# EAGLE design TECDriver Low Voltage (EAGLE 9.6.2)
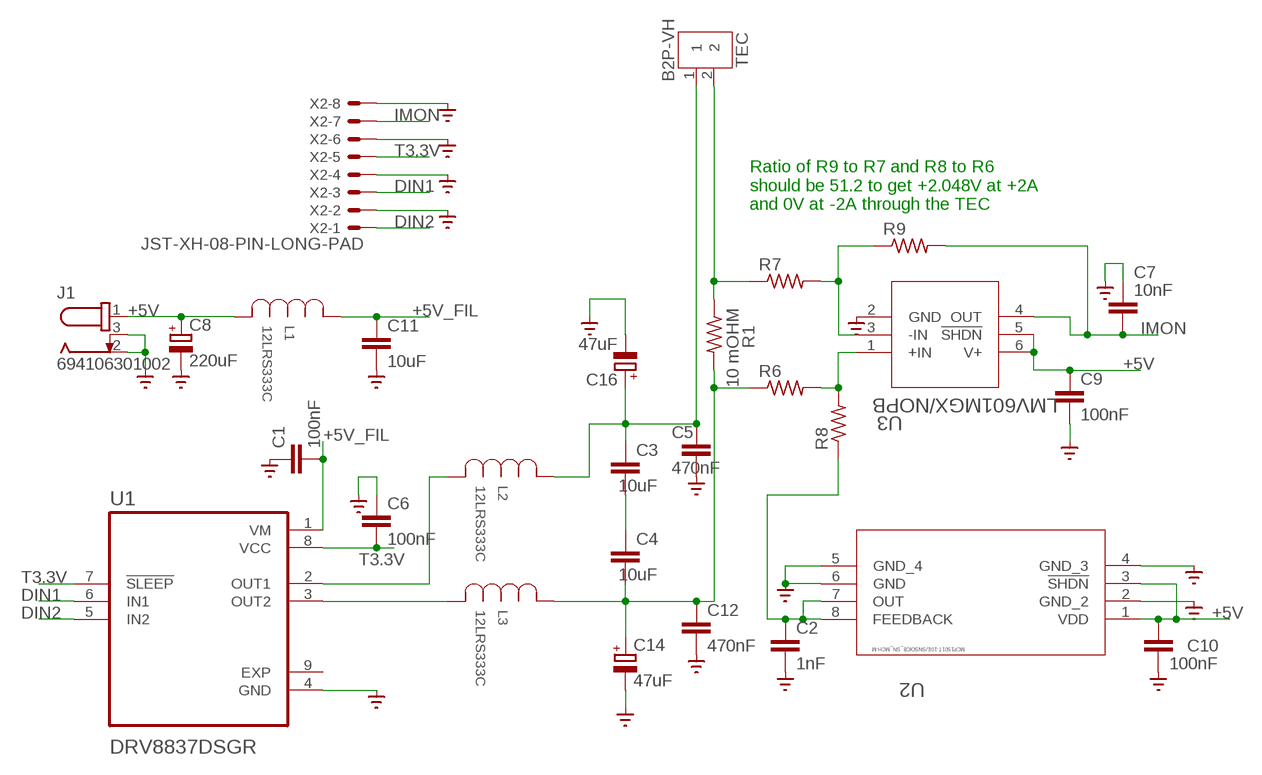
[diagram p0: schematic, sheet 1]

## Parts
C1  100nF  C-EUC0603  [C0603]
C2  1nF  C-EUC0603  [C0603]
C3  10uF  C-EUC1206  [C1206]
C4  10uF  C-EUC1206  [C1206]
C5  470nF  C-EUC1206  [C1206]
C6  100nF  C-EUC0603  [C0603]
C7  10nF  C-EUC0603  [C0603]
C8  220uF  CPOL-EUE3.5-8  [E3,5-8]
C9  100nF  C-EUC0603  [C0603]
C10  100nF  C-EUC0603  [C0603]
C11  10uF  C-EUC1206  [C1206]
C12  470nF  C-EUC1206  [C1206]
C14  47uF  CPOL-EU175TMP-0808  [175TMP-0808]
C16  47uF  CPOL-EU175TMP-0808  [175TMP-0808]
J1  694106301002  [694106301002]
L1  12LRS333C  [IND_MURATA_1200LRS_MUR]
L2  12LRS333C  [IND_MURATA_1200LRS_MUR]
L3  12LRS333C  [IND_MURATA_1200LRS_MUR]
R1  10 mOHM  R-US_R1206  [R1206]
R6  R-US_R1206  [R1206]
R7  R-US_R1206  [R1206]
R8  R-US_R1206  [R1206]
R9  R-US_R1206  [R1206]
TEC  B2P-VH  [B2P-VH_396-2N]
U1  DRV8837DSGR  [SON50P200X200X80-9N]
U2  MCP1501T-10E/SNSOIC8_SN_MCH-M  [SOIC8_SN_MCH-M]
U3  LMV601MGX/NOPB  [DCK6_TEX]
X2  JST-XH-08-PIN-LONG-PAD  [JST-XH-08-PACKAGE-LONG-PAD]

## Nets
+5V: C8.+ C9.1 C10.1 J1.1 L1.3 U2.1(VDD) U2.3(!SHDN) U3.5(!SHDN) U3.6(V+)
+5V_FIL: C1.2 C11.1 L1.1 U1.1(VM)
DIN1: U1.6(IN1) X2.3
DIN2: U1.5(IN2) X2.1
GND: C1.1 C2.2 C5.2 C6.1 C7.1 C8.- C9.2 C10.2 C11.2 C12.2 C14.- C16.- J1.2 J1.3 U1.4(GND) U2.2(GND_2) U2.4(GND_3) U2.5(GND_4) U2.6(GND) U3.2(GND) X2.2 X2.4 X2.6 X2.8 ; supply symbol labelled SUPPLY0_GND_
IMON: C7.2 R9.2 U3.4(OUT) X2.7
N$1: R6.2 R8.2 U3.1(+IN)
N$2: C2.1 R8.1 U2.7(OUT) U2.8(FEEDBACK)
N$5: L2.3 U1.2(OUT1)
N$7: L3.3 U1.3(OUT2)
N$8: R7.2 R9.1 U3.3(-IN)
N$9: C3.1 C5.1 C16.+ L2.1 TEC.1
N$10: C3.2 C4.1
N$11: C4.2 C12.1 C14.+ L3.1 R1.2 R6.1
N$14: R1.1 R7.1 TEC.2
T3.3V: C6.2 U1.7(!SLEEP) U1.8(VCC) X2.5

## Notes on the sheet
- Ratio of R9 to R7 and R8 to R6 
  should be 51.2 to get +2.048V at +2A
  and 0V at -2A through the TEC

## Power pins joined to a net without a drawn wire
EXP: U1.9(EXP)

## Library data of the parts
C1-C7 C9-C12 = rcl:C-EU: CAPACITOR, European symbol; SPICEPREFIX: C
C8 C14 C16 = rcl:CPOL-EU: POLARIZED CAPACITOR, European symbol; SPICEPREFIX: C
J1 = DC Power Jacks:694106301002: CONN PWR JACK 2.1X5.5MM SOLDER Manufacturer's datasheet <https://katalog.we-online.de/em/datasheet/6941xx301002.pdf>; CREATED_BY: PCBLayout.com; DIGIKEY_PART_NUMBER: 732-5930-ND; MANUFACTURER: Wurth Electronics Inc.; MPN: 694106301002
L1-L3 = 12LRS333C:12LRS333C: MURATA 33uH 2.1A INDUCTOR; BUILT_BY: EMA_UL_Team; MANUFACTURER_PART_NUMBER: 12LRS333C; SOURCELIBRARY: Murata_2010-01-01IND_1200LRS; VENDOR: Murata
R1 R6-R9 = rcl:R-US_: RESISTOR, American symbol; SPICEPREFIX: R
TEC = Connector:B2P-VH: VH Connector Top Entry - 2POS, 3.96MM Details see: Datasheet <http://www.jst-mfg.com/product/pdf/eng/eVH.pdf>; CATEGORY: Connector; DESCRIPTION: CONN HEADER VERT 2POS 3.96MM; MANUFACTURER: JST Sales America Inc.; MPN: B2P-VH; OPERATING_TEMPERATURE: -25°C ~ 85°C; PART_STATUS: Active; ROHS_COMPLIANCE: RoHS2 Compliant; SERIES: VH; TYPE: Top Entry
U1 = DRV8837DSGR:DRV8837DSGR: Check prices <https://pricing.snapeda.com/parts/DRV8837DSGR/Texas%20Instruments/view-part?ref=eda>; AVAILABILITY: In Stock; DESCRIPTION: 11-V, 1.8-A H-bridge motor driver 8-WSON -40 to 85; MF: Texas Instruments; MP: DRV8837DSGR; PACKAGE: WSON-8 Texas Instruments; PRICE: None; PURCHASE-URL: https://pricing.snapeda.com/search/part/DRV8837DSGR/?ref=eda
U2 = MCP1501T-10E:Sn:MCP1501T-10E/SN; COPYRIGHT: Copyright (C) 2022 Ultra Librarian. All rights reserved.; MANUFACTURER_PART_NUMBER: MCP1501T-10E/SN; MFR_NAME: Microchip
U3 = LMV601MGX:NOPB:LMV601MGX/NOPB; COPYRIGHT: Copyright (C) 2022 Ultra Librarian. All rights reserved.; DIGI-KEY_PART_NUMBER_1: 296-46438-1-ND; DIGI-KEY_PART_NUMBER_2: 296-46438-2-ND; DIGI-KEY_PART_NUMBER_3: 296-46438-6-ND; DIGI-KEY_PART_NUMBER_4: LMV601MGX/NOPB-ND; MANUFACTURER_PART_NUMBER: LMV601MGX/NOPB; MFR_NAME: Texas Instruments
X2 = Rembrandt Electronics - JST XH Connectors v1-0:JST-XH-08-PIN: JST XH Connector 2 Pin Wire to board connector. Pitch: 2,54 mm, (0.100") Number of pins: 8 Created by Rembrandt Electronics www.rembrandtelectronics.com

## Board
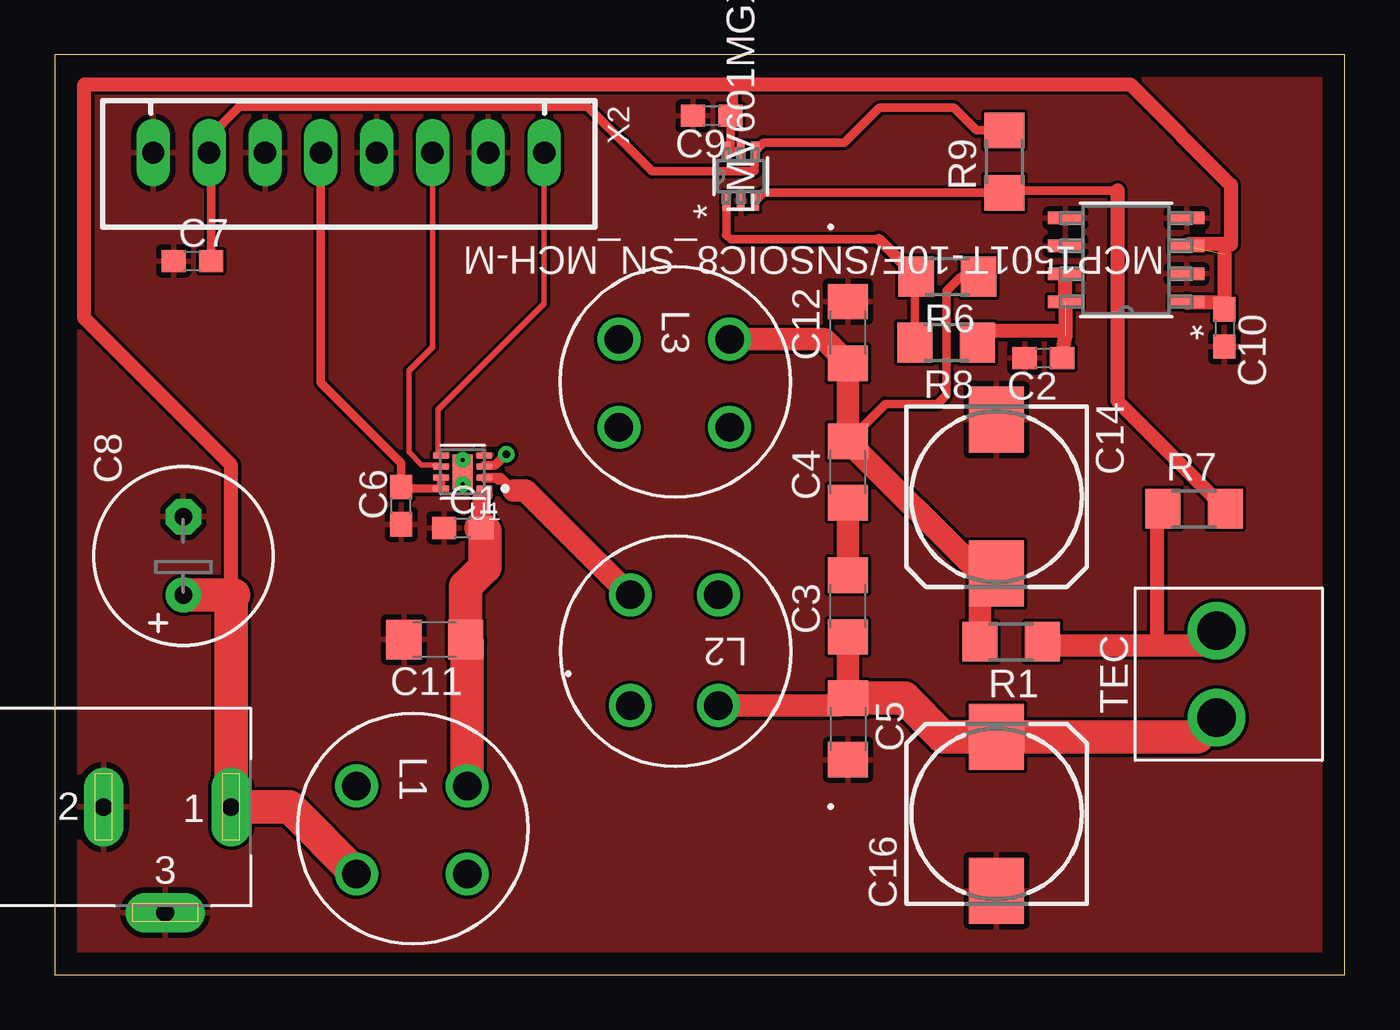
[diagram p1: board, top side]
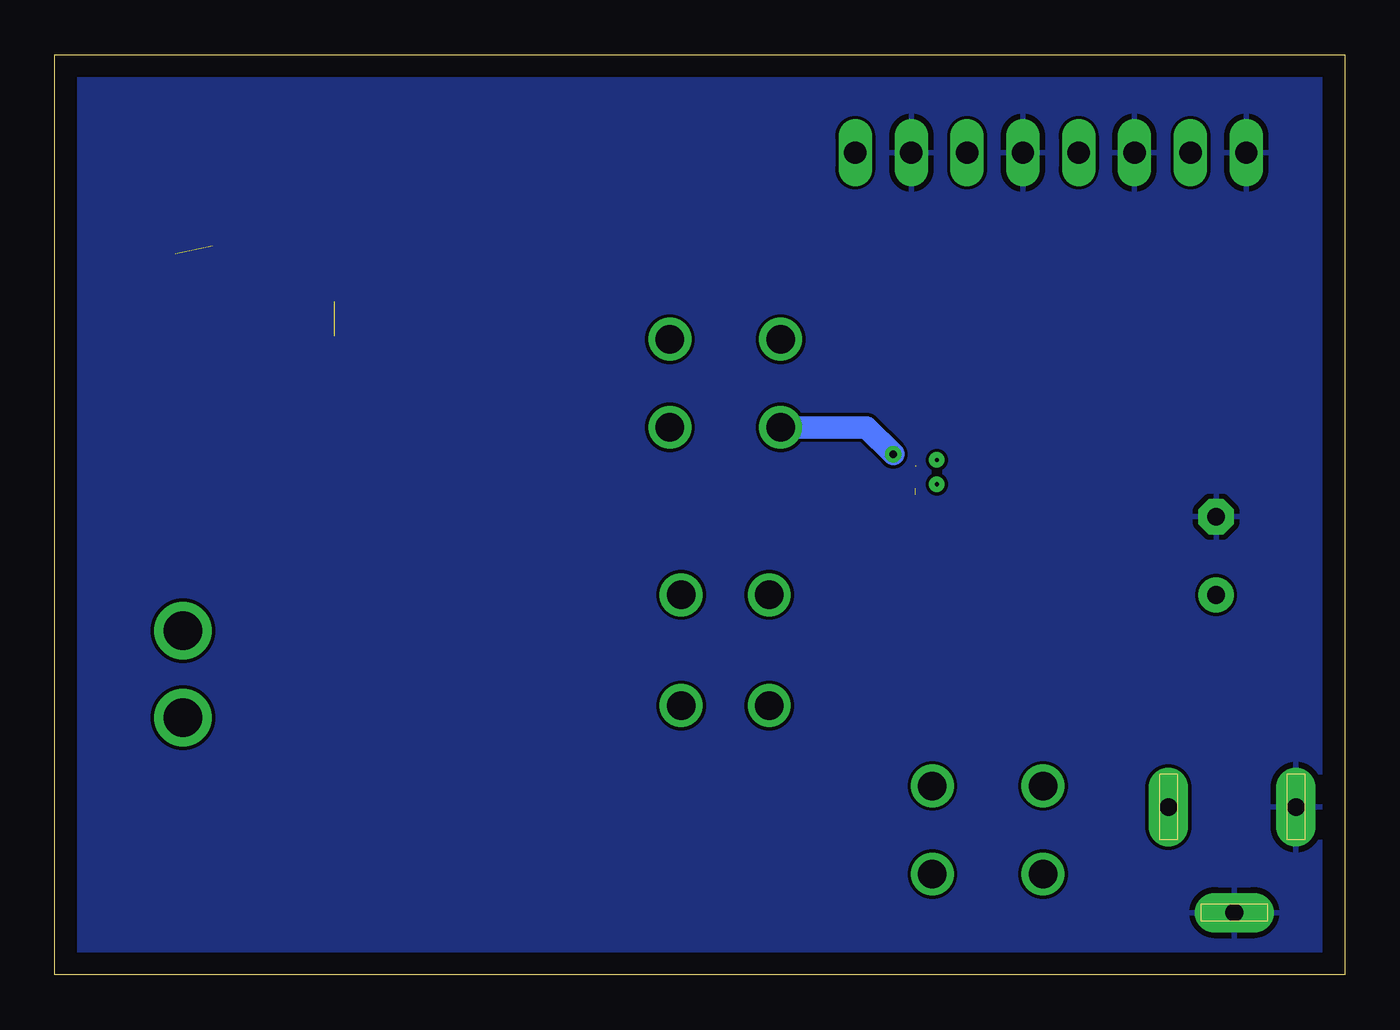
[diagram p2: board, bottom side, seen from below]

Size 58.65 x 41.83 mm. Coordinates in mm from the lower left corner, seen from the top.
Outline: 0,0 58.65,0 58.65,41.83 0,41.83 0,0
Copper layers (1*16): Top 0.035mm / dielectric 1.5mm / Bottom 0.035mm
Design rules "default": minimum track width 6mil, minimum drill 0.35mm, track to track 6mil, track to pad 6mil, pad to pad 6mil, via to via 6mil, smd to smd 6mil, copper to edge 40mil, drill to drill 6mil, minimum pad ring 10mil, minimum via ring 8mil, stop-mask expansion 4mil, vias tented up to drill 0mil, thermal gap 10mil

### Footprints (pad centres in the part's own frame; a part is rotated, then mirrored left to right if it is on the bottom)
C0603 = smd 1.1 x 1: 1 -0.85,0; 2 0.85,0
C1206 = smd 1.6 x 1.8: 1 -1.4,0; 2 1.4,0
E3,5-8 = drill 0.813 pad 1.6: + -1.778,0 | drill 0.813 pad 1.6 octagon: - 1.778,0
175TMP-0808 = smd 3 x 2.5: + 3.5,0; - -3.5,0
694106301002 = drill 0.8 pad 1.8 long: 1 13.6,0; 2 7.8,0; 3 10.6,-4.8
IND_MURATA_1200LRS_MUR = drill 1.295 pad 1.803: 1 -4.775,5.283; 2 -4.775,0.254; 3 -0.762,0.254; 4 -0.762,5.283
R1206 = smd 1.6 x 1.803: 1 -1.422,0; 2 1.422,0
B2P-VH_396-2N = drill 1.75: 1 0,0; 2 3.96,0
SON50P200X200X80-9N = smd 0.74 x 0.28: 1 -0.985,0.75; 2 -0.985,0.25; 3 -0.985,-0.25; 4 -0.985,-0.75; 5 0.985,-0.75; 6 0.985,-0.25; 7 0.985,0.25; 8 0.985,0.75 | smd 0.9 x 1.6: 9 0,0 | drill 0.2 pad 0.4: 9_1 0,0.55; 9_2 0,-0.55
SOIC8_SN_MCH-M = smd 1.6 x 0.559: 1 -2.756,1.905; 2 -2.756,0.635; 3 -2.756,-0.635; 4 -2.756,-1.905; 5 2.756,-1.905; 6 2.756,-0.635; 7 2.756,0.635; 8 2.756,1.905
DCK6_TEX = smd 0.851 x 0.356: 1 -1.137,0.65; 2 -1.137,0; 3 -1.137,-0.65; 4 1.137,-0.65; 5 1.137,0; 6 1.137,0.65
JST-XH-08-PACKAGE-LONG-PAD = drill 1.016 long: 1 -8.89,0; 2 -6.35,0; 3 -3.81,0; 4 -1.27,0; 5 1.27,0; 6 3.81,0; 7 6.35,0; 8 8.89,0

### Placement (x,y rotation side)
C1  18.54,20.32 0 top
C2  44.96,28.04 180 top
C3  36.07,16.76 90 top
C4  36.07,22.86 90 top
C5  36.07,11.18 270 top
C6  15.75,21.34 90 top
C7  6.25,32.46 0 top
C8  5.84,19.05 90 top
C9  29.87,39.07 180 top
C10  53.19,29.41 270 top
C11  17.27,15.24 180 top
C12  36.07,29.21 90 top
C14  42.82,21.74 270 top
C16  42.82,7.32 90 top
J1  -5.59,7.62 0 top
L1  13.46,3.81 270 top
L2  25.4,17.53 180 top
L3  25.4,24.13 270 top
R1  43.48,15.14 180 top
R6  40.59,31.75 180 top
R7  51.82,21.18 0 top
R8  40.54,28.75 180 top
R9  43.18,36.98 90 top
TEC  52.83,11.68 90 top
U1  18.54,22.86 180 top
U2  48.72,32.51 180 top
U3  31.19,36.32 90 top
X2  13.36,37.39 180 top

### Tracks (layer width: path | path; a pad name or v marks a point on that pad's centre or on a via)
+5V  (1 unrouted)
  Top 0.381: 30.89,40.5 30.89,39.23 C9.1 30.72,37.64 U3.6 U3.5
  Top 0.635: 8.01,17.16 8.01,23.18 1.33,29.86 1.33,40.5 30.89,40.5 48.91,40.5 53.49,35.92 53.49,33.22 51.55,33.22 U2.3 | 53.19,32.77 C10.1 52.88,30.57 51.51,30.57 U2.1
  Top 1.524: L1.3 10.67,7.62 J1.1 8.01,17.16 8.13,17.27 C8.+
+5V_FIL  (1 unrouted)
  Top 0.762: C1.2 19.39,21.71 19.53,21.84
  Top 1.524: L1.1 18.75,15.17 C11.1 18.67,17.66 19.56,18.54 19.56,20.15 C1.2
DIN1
  Top 0.254: X2.3 17.17,28.55 16.1,27.48 16.1,23.77 16.69,23.19 17.48,23.19 U1.6
DIN2
  Top 0.254: X2.1 22.25,30.53 17.42,25.71 17.42,23.74 U1.5
GND
  pour Top: 0.15,41.86 58.62,41.86 58.78,41.71 58.78,0.2 58.67,0.1 0.25,0.1 0.1,-0.05
  pour Bottom: 58.72,41.76 58.78,41.71 58.78,0.1 0.46,0.1 0.25,-0.1 0.25,41.81
IMON
  Top 0.381: R9.2 41.91,38.4 40.89,39.43 37.49,39.43 35.91,37.85 32.23,37.85 U3.4 31.83,37.44 31.83,36.54 27.17,36.54 24.23,39.47 8.38,39.47 7.01,38.1 X2.7 7.1,37.3 C7.2
N$1
  Top 0.381: R8.2 39.12,31.7 R6.2 | U3.1 30.54,33.64 30.53,33.63 30.72,33.45 37.47,33.45
  Top 0.508: 37.47,33.45 R6.2
N$2  (1 unrouted)
  Top 0.635: C2.1 45.96,29.06 | R8.1 41.96,28.93 42.3,29.27 45.96,29.27 U2.8 U2.7
N$5
  Top 0.457: 25.91,17.27 L2.3 | 20.37,22.5 20.16,22.5 20.14,22.53 | 20.37,22.5 20.85,22.02 | U1.2 20.27,22.61 20.37,22.5
  Top 1.016: 20.85,22.02 21.41,22.02 L2.3
N$7  (via drill 0.35)  (1 unrouted)
  Top 0.406: 19.53,23.16 20.01,23.16 v20.52,23.67
  Bottom 1.016: v20.52,23.67 21.74,24.89 L3.3
N$8
  Top 0.381: 48.33,35.66 43.28,35.66 R9.1 32.22,35.56 U3.3
  Top 0.635: R7.2 48.33,26.09 48.33,35.66
N$9
  Top 1.016: L2.1 35.73,12.24 C5.1 C3.1
  Top 1.524: C5.1 38.63,12.58 40.39,10.82 C16.+ 51.96,10.82 TEC.1
N$10
  Top 1.016: C3.2 C4.1
N$11
  Top 0.381: C4.2 37.77,25.96 40.13,25.96 40.54,26.37 40.54,31.09 41.2,31.75 R6.1
  Top 1.016: L3.1 34.97,28.91 C12.1 C4.2 42.09,18.24 C14.+ 42.06,17.48 R1.2
N$14
  Top 0.635: 50.14,14.98 50.14,20.93 R7.1
  Top 1.016: R1.1 45.06,14.98 50.14,14.98 52.17,14.98 TEC.2
T3.3V
  Top 0.381: X2.5 12.09,26.92 15.75,23.27 C6.2 15.82,22.11 U1.8 U1.7